# Altium schematic sheet TOP.SchDoc: Title
size A3; Project: QFSAE VCU; ENG_APP_DATE: --/--/--; DSN_APP_DATE: --/--/--; CHK_APP_DATE: --/--/--; Date: *******; ApprovedBy: *******; CheckedBy: None; Author: *******; CompanyName: *******; DrawnBy: Jacob Chisholm; Engineer: *******; Organization: *******; Address1: *******; Address2: *******; Address3: *******; Address4: *******; DocumentNumber: 1; Revision: *******; SheetNumber: 1; SheetTotal: 14; Address_Website: https://jchisholm204.github.io; E-Mail: JacobChisholm1010@gmail.com; CurrentTime: *******; CurrentDate: *******; Time: *******; DocumentFullPathAndName: *******; DocumentName: *******; ModifiedDate: *******; ImagePath: *******; ProjectName: *******; Application_BuildNumber: *******
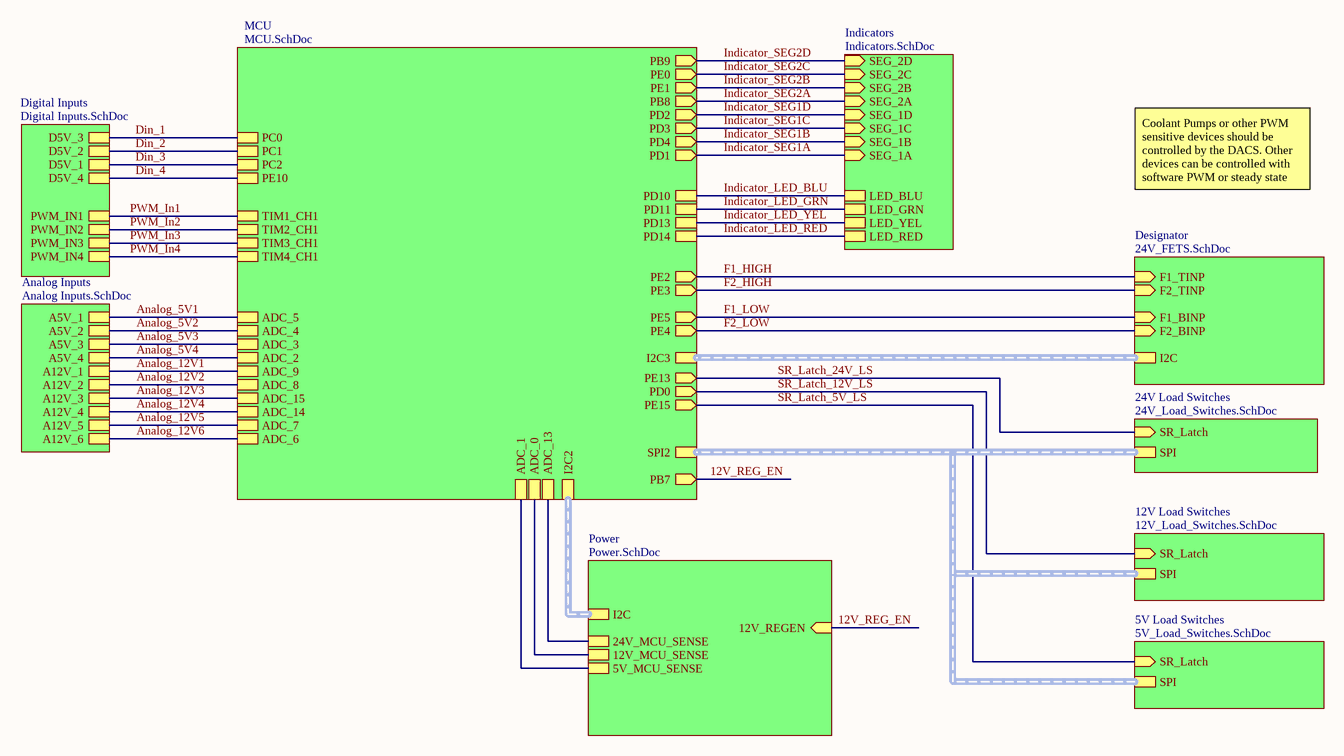
[diagram p0: TOP.SchDoc]

## Sub-sheets
5V Load Switches = 5V_Load_Switches.SchDoc: SR_Latch (in), SPI (harness SPI)
12V Load Switches = 12V_Load_Switches.SchDoc: SPI (harness SPI), SR_Latch (in)
24V Load Switches = 24V_Load_Switches.SchDoc: SR_Latch (in), SPI (harness SPI)
Analog Inputs = Analog Inputs.SchDoc: A5V_1, A5V_2, A5V_3, A5V_4, A12V_1, A12V_2, A12V_3, A12V_4, A12V_5, A12V_6
Designator = 24V_FETS.SchDoc: I2C (harness I2C), F1_BINP (in), F2_TINP (in), F2_BINP (in), F1_TINP (in)
Digital Inputs = Digital Inputs.SchDoc: PWM_IN1, PWM_IN2, PWM_IN3, PWM_IN4, D5V_1, D5V_2, D5V_3, D5V_4
Indicators = Indicators.SchDoc: LED_RED, LED_YEL, LED_GRN, LED_BLU, SEG_1A (in), SEG_1B (in), SEG_1C (in), SEG_1D (in), SEG_2A (in), SEG_2B (in), SEG_2C (in), SEG_2D (in)
MCU = MCU.SchDoc: SPI2 (harness SPI), I2C3 (harness I2C), I2C2 (harness I2C), ADC_1, ADC_2, ADC_3, ADC_6, ADC_7, ADC_8, ADC_9, ADC_13, ADC_14, ADC_15, TIM3_CH1, TIM4_CH1, TIM2_CH1, ADC_0, ADC_5, ADC_4, TIM1_CH1, PD10, PD11, PD13, PD14, PE2 (out), PE3 (out), PE4 (out), PE5 (out), PE13 (out), PD0 (out), PE15 (out), PB7 (out), PD1 (out), PD2 (out), PD3 (out), PD4 (out), PE0 (out), PE1 (out), PB8 (out), PB9 (out), PC0, PC1, PC2, PE10
Power = Power.SchDoc: I2C (harness I2C), 12V_REGEN (in), 24V_MCU_SENSE, 12V_MCU_SENSE, 5V_MCU_SENSE

## Nets
12V_REG_EN: sheet MCU/PB7, sheet Power/12V_REGEN
Analog_5V1: sheet MCU/ADC_5, sheet Analog Inputs/A5V_1
Analog_5V2: sheet MCU/ADC_4, sheet Analog Inputs/A5V_2
Analog_5V3: sheet MCU/ADC_3, sheet Analog Inputs/A5V_3
Analog_5V4: sheet MCU/ADC_2, sheet Analog Inputs/A5V_4
Analog_12V1: sheet MCU/ADC_9, sheet Analog Inputs/A12V_1
Analog_12V2: sheet MCU/ADC_8, sheet Analog Inputs/A12V_2
Analog_12V3: sheet MCU/ADC_15, sheet Analog Inputs/A12V_3
Analog_12V4: sheet MCU/ADC_14, sheet Analog Inputs/A12V_4
Analog_12V5: sheet MCU/ADC_7, sheet Analog Inputs/A12V_5
Analog_12V6: sheet MCU/ADC_6, sheet Analog Inputs/A12V_6
Din_1: sheet MCU/PC0, sheet Digital Inputs/D5V_3
Din_2: sheet MCU/PC1, sheet Digital Inputs/D5V_2
Din_3: sheet MCU/PC2, sheet Digital Inputs/D5V_1
Din_4: sheet MCU/PE10, sheet Digital Inputs/D5V_4
F1_HIGH: sheet MCU/PE2, sheet Designator/F1_TINP
F1_LOW: sheet MCU/PE5, sheet Designator/F1_BINP
F2_HIGH: sheet MCU/PE3, sheet Designator/F2_TINP
F2_LOW: sheet MCU/PE4, sheet Designator/F2_BINP
Indicator_LED_BLU: sheet MCU/PD10, sheet Indicators/LED_BLU
Indicator_LED_GRN: sheet MCU/PD11, sheet Indicators/LED_GRN
Indicator_LED_RED: sheet MCU/PD14, sheet Indicators/LED_RED
Indicator_LED_YEL: sheet MCU/PD13, sheet Indicators/LED_YEL
Indicator_SEG1A: sheet MCU/PD1, sheet Indicators/SEG_1A
Indicator_SEG1B: sheet MCU/PD4, sheet Indicators/SEG_1B
Indicator_SEG1C: sheet MCU/PD3, sheet Indicators/SEG_1C
Indicator_SEG1D: sheet MCU/PD2, sheet Indicators/SEG_1D
Indicator_SEG2A: sheet MCU/PB8, sheet Indicators/SEG_2A
Indicator_SEG2B: sheet MCU/PE1, sheet Indicators/SEG_2B
Indicator_SEG2C: sheet MCU/PE0, sheet Indicators/SEG_2C
Indicator_SEG2D: sheet MCU/PB9, sheet Indicators/SEG_2D
PWM_In1: sheet MCU/TIM1_CH1, sheet Digital Inputs/PWM_IN1
PWM_In2: sheet MCU/TIM2_CH1, sheet Digital Inputs/PWM_IN2
PWM_In3: sheet MCU/TIM3_CH1, sheet Digital Inputs/PWM_IN3
PWM_In4: sheet MCU/TIM4_CH1, sheet Digital Inputs/PWM_IN4
SR_Latch_5V_LS: sheet MCU/PE15, sheet 5V Load Switches/SR_Latch
SR_Latch_12V_LS: sheet MCU/PD0, sheet 12V Load Switches/SR_Latch
SR_Latch_24V_LS: sheet MCU/PE13, sheet 24V Load Switches/SR_Latch
(unnamed): sheet MCU/ADC_1, sheet Power/5V_MCU_SENSE
(unnamed): sheet MCU/ADC_13, sheet Power/24V_MCU_SENSE
(unnamed): sheet MCU/ADC_0, sheet Power/12V_MCU_SENSE

## Buses and harness runs
harness sheet 5V Load Switches/SPI = sheet 12V Load Switches/SPI = sheet 24V Load Switches/SPI = sheet MCU/SPI2
harness sheet Designator/I2C = sheet MCU/I2C3
harness sheet MCU/I2C2 = sheet Power/I2C

## Notes on the sheet
- Coolant Pumps or other PWM sensitive devices should be controlled by the DACS. Other devices can be controlled with software PWM or steady state
- Title:
- Drawn By:
- Page Contents:
- Checked By:
- Size:
- Date:
- File:
- License:
- Email:
- A3
- Number:
- Time:
- Revision:
- Sheet
- Website:
- of